# EAGLE design ALogShield (EAGLE 7.7.0)

## Sheet 1 of 2
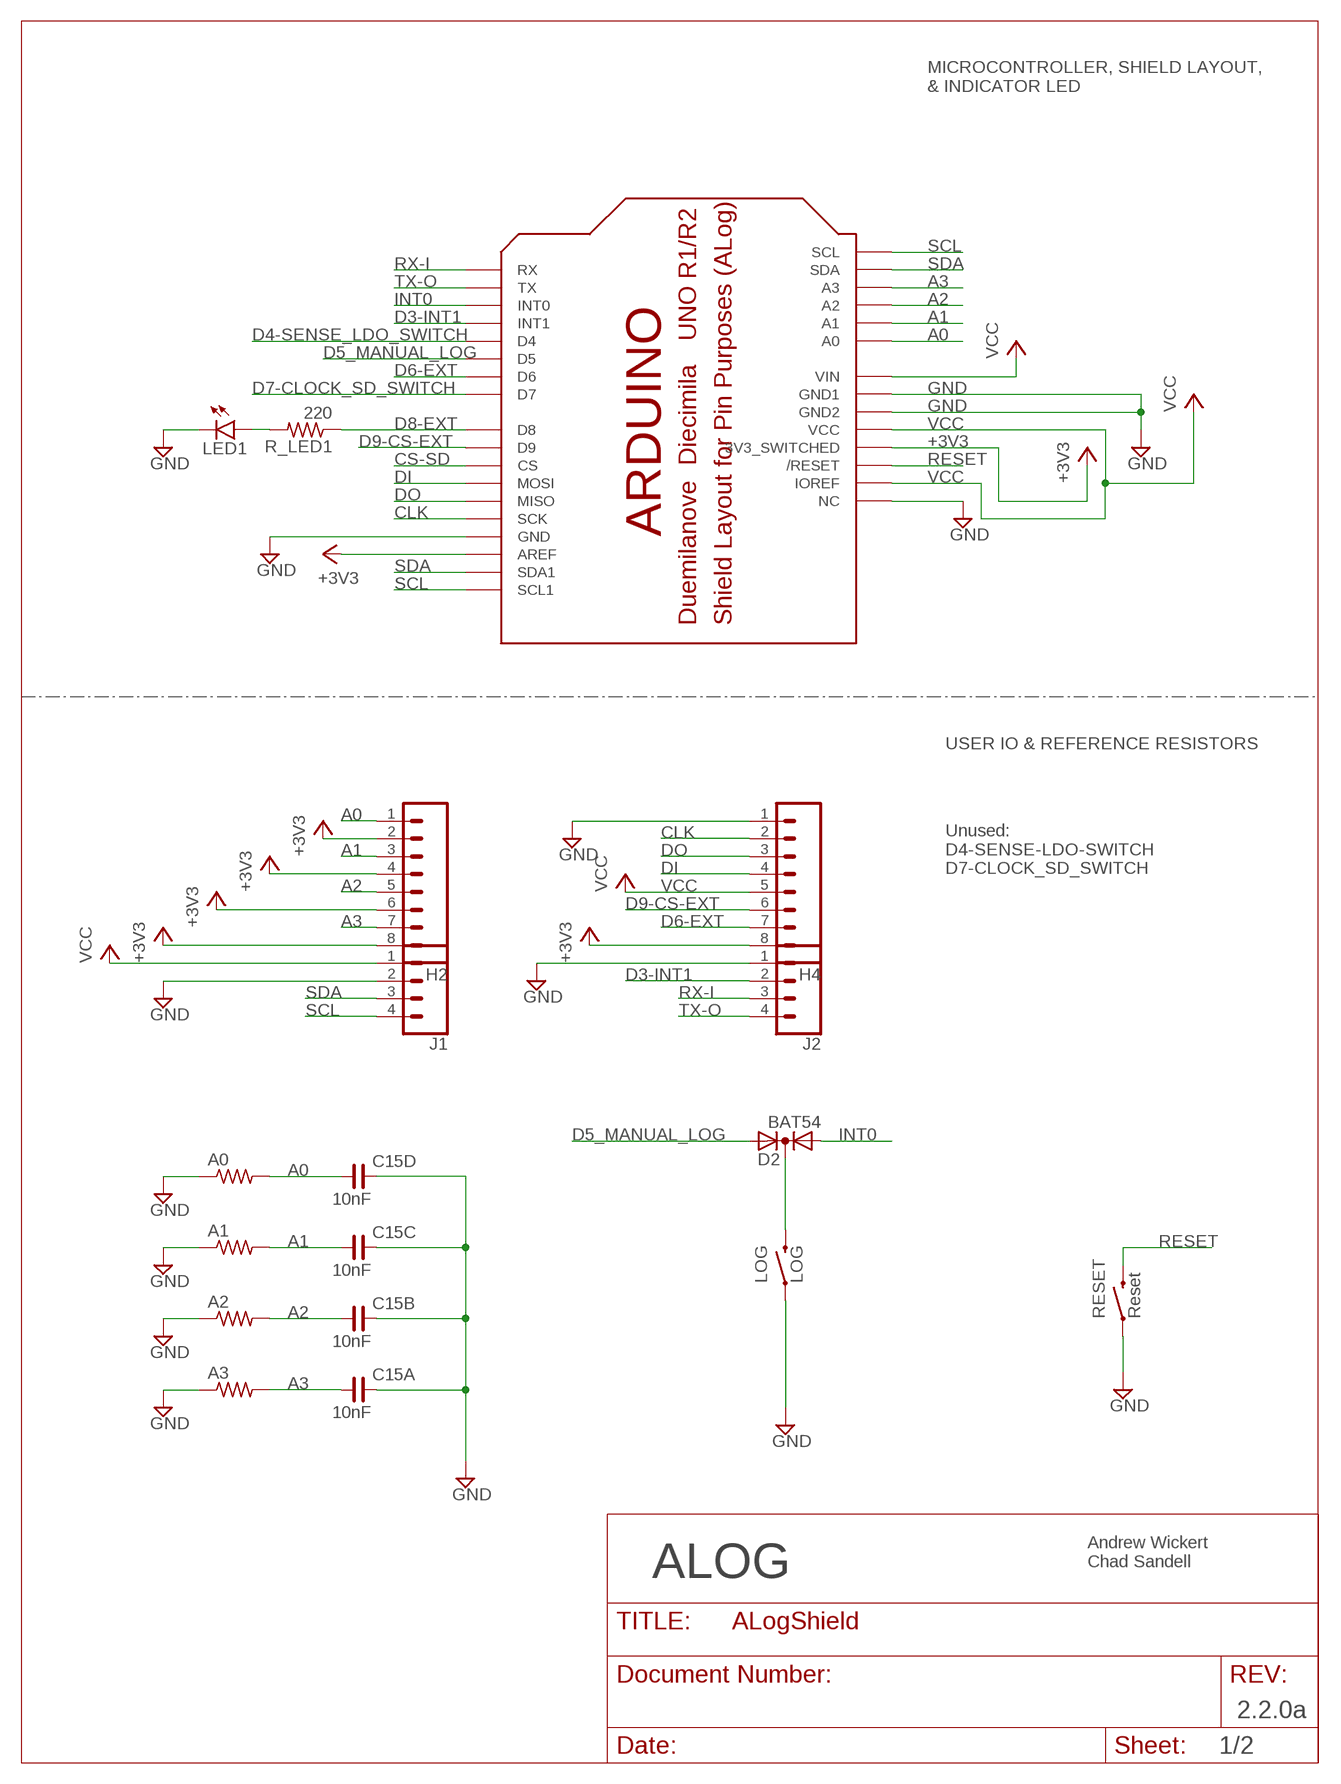
[diagram p0: schematic, sheet 1]

### Parts
A0  R-US_0207/10  [0207/10]
A1  R-US_0207/10  [0207/10]
A2  R-US_0207/10  [0207/10]
A3  R-US_0207/10  [0207/10]
C15  10nF  CCA_  [CECJ-CTS-031817]
D2  BAT54  DIODE_AC-CA_  [SOT23C]
H2  M083.5MM-8  [SCREWTERMINAL-3.5MM-8]
H4  M083.5MM-8  [SCREWTERMINAL-3.5MM-8]
J1  CONN_04SCREW  [SCREWTERMINAL-3.5MM-4]
J2  CONN_04SCREW  [SCREWTERMINAL-3.5MM-4]
LED1  LED1206  [LED-1206]
LOG  LOG  SWITCH-MOMENTARY-2PTH  [TACTILE-PTH]
R_LED1  220  R-US_R0603  [R0603]
RESET  Reset  SWITCH-MOMENTARY-2PTH  [TACTILE-PTH]
U$9  ARDUINO_SHIELD_PIN_PURPOSE  [ARDUINO_SHIELD_PINS_ONLY]

### Nets
+3V3: H2.2 H2.4 H2.6 H2.8 H4.8 U$9.3.3V(3V3_SWITCHED) U$9.AREF ; also sheet 2
A0: A0.2 C15.D1 H2.1 U$9.A0
A1: A1.2 C15.C1 H2.3 U$9.A1
A2: A2.2 C15.B1 H2.5 U$9.A2
A3: A3.2 C15.A1 H2.7 U$9.A3
CLK: H4.2 U$9.D13(SCK) ; also sheet 2
CS-SD: U$9.D10(CS) ; also sheet 2
D3-INT1: J2.2 U$9.D3(INT1)
D4-SENSE_LDO_SWITCH: U$9.D4
D5_MANUAL_LOG: D2.2(A2) U$9.D5
D6-EXT: H4.7 U$9.D6
D7-CLOCK_SD_SWITCH: U$9.D7
D8-EXT: R_LED1.1 U$9.D8
D9-CS-EXT: H4.6 U$9.D9
DI: H4.4 U$9.D11(MOSI) ; also sheet 2
DO: H4.3 U$9.D12(MISO) ; also sheet 2
GND: A0.1 A1.1 A2.1 A3.1 C15.A2 C15.B2 C15.C2 C15.D2 H4.1 J1.2 J2.1 LED1.C LOG.1 RESET.1 U$9.GND@0(GND) U$9.GND@1(GND1) U$9.GND@2(GND2) U$9.NC ; also sheet 2
INT0: D2.1(A1) U$9.D2(INT0) ; also sheet 2
LED+1: LED1.A R_LED1.2
N$11: D2.3(K) LOG.3
RESET: RESET.3 U$9.RES(/RESET)
RX-I: J2.3 U$9.RX
SCL: J1.4 U$9.A5(SCL) U$9.SCL(SCL1) ; also sheet 2
SDA: J1.3 U$9.A4(SDA) U$9.SDA(SDA1) ; also sheet 2
TX-O: J2.4 U$9.TX
VCC: H4.5 J1.1 U$9.5V(VCC) U$9.IOREF U$9.VIN ; also sheet 2

### Notes on the sheet
- MICROCONTROLLER, SHIELD LAYOUT,
  & INDICATOR LED
- USER IO & REFERENCE RESISTORS
- Unused:
  D4-SENSE-LDO-SWITCH
  D7-CLOCK_SD_SWITCH
- Andrew Wickert
  Chad Sandell
- ALOG
- 2.2.0a
- 1/2

## Sheet 2 of 2
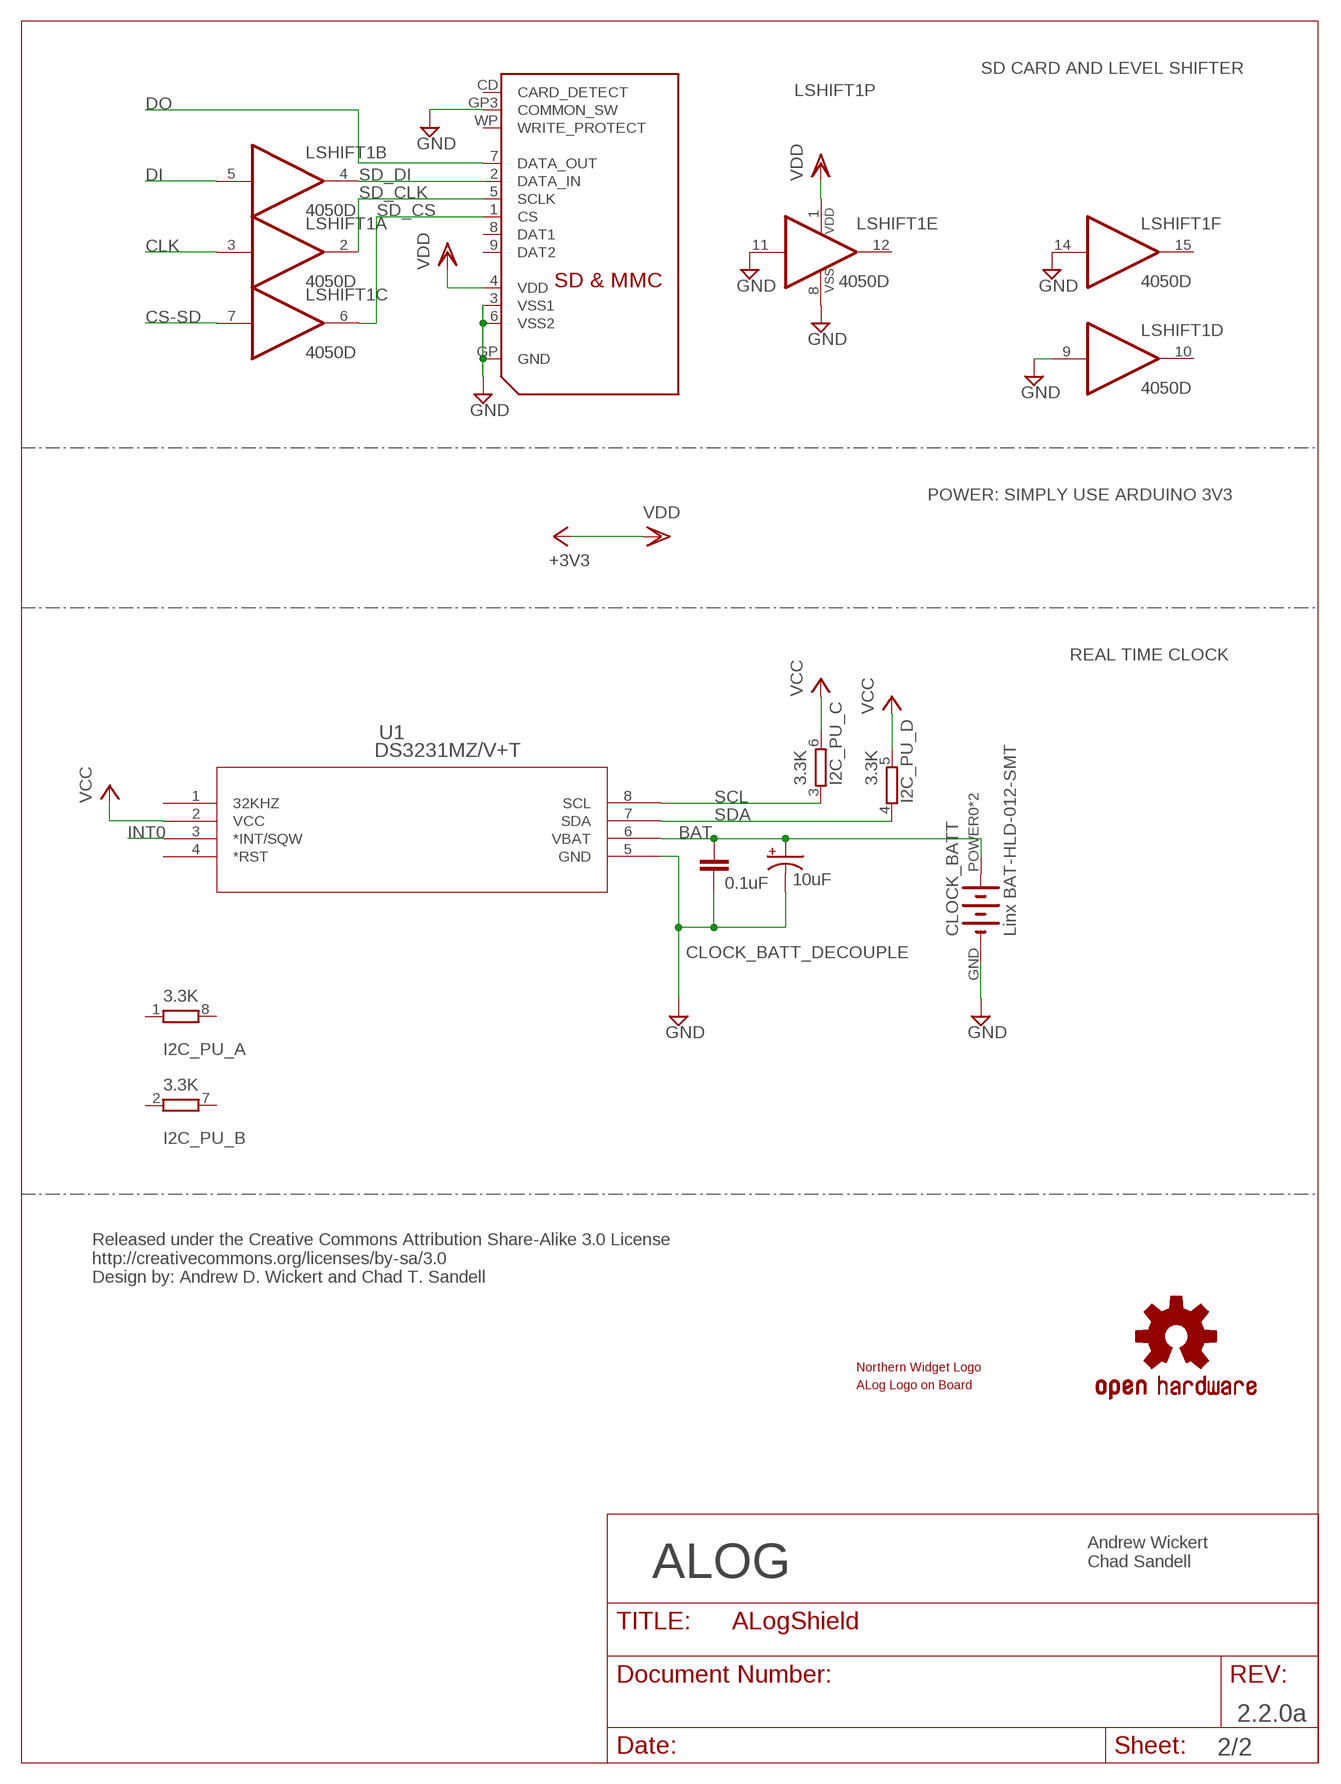
[diagram p1: schematic, sheet 2]

### Parts
CLOCK_BATT  Linx BAT-HLD-012-SMT  LINX-BAT-HLD-012-SMT-OTL  [LINX_BAT-HLD-012-SMT]
CLOCK_BATT_DECOUP  0.1uF  C-EUC0603  [C0603]
CLOCK_BATT_DECOUPLE  10uF  CAP_POL1206  [EIA3216]
I2C_PU_  3.3K  4R-N0603-ARC  [0603-ARC]
LOGO2  OSHW-LOGOM  [OSHW-LOGO-M]
LSHIFT1  4050D  [SO16]
SD1  SDMMC06132  [06132]
U1  DS3231MZ/V+T  [21-0041B_8]
U$1  ALOG_LOGO_V1_5.5MM  [ALOG_LOGO_V1_SMALL]
U$4  NWLOGO  [NWLOGO]

### Nets
BAT: CLOCK_BATT.POWER0(+) CLOCK_BATT.POWER1(+) CLOCK_BATT_DECOUP.1 CLOCK_BATT_DECOUPLE.A(+) U1.6(VBAT)
CLK: LSHIFT1.3(A:I) ; also sheet 1
CS-SD: LSHIFT1.7(C:I) ; also sheet 1
DI: LSHIFT1.5(B:I) ; also sheet 1
DO: SD1.7(DATA_OUT) ; also sheet 1
GND: CLOCK_BATT.GND(-) CLOCK_BATT_DECOUP.2 CLOCK_BATT_DECOUPLE.C(-) LSHIFT1.8(P:VSS) LSHIFT1.9(D:I) LSHIFT1.11(E:I) LSHIFT1.14(F:I) SD1.3(VSS1) SD1.6(VSS2) SD1.GP3(COMMON_SW) SD1.GP(GND) U1.5(GND) ; also sheet 1
INT0: U1.3(*INT/SQW) ; also sheet 1
SCL: I2C_PU_.3 U1.8(SCL) ; also sheet 1
SD_CLK: LSHIFT1.2(A:O) SD1.5(SCLK)
SD_CS: LSHIFT1.6(C:O) SD1.1(CS)
SD_DI: LSHIFT1.4(B:O) SD1.2(DATA_IN)
SDA: I2C_PU_.4 U1.7(SDA) ; also sheet 1
VCC: I2C_PU_.5 I2C_PU_.6 U1.2(VCC) ; also sheet 1
VDD: LSHIFT1.1(P:VDD) SD1.4(VDD)
Unconnected: I2C_PU_.1 I2C_PU_.2 I2C_PU_.7 I2C_PU_.8 LSHIFT1.10(D:O) LSHIFT1.12(E:O) LSHIFT1.15(F:O) SD1.8(DAT1) SD1.9(DAT2) SD1.CD(CARD_DETECT) SD1.WP(WRITE_PROTECT) U1.1(32KHZ) U1.4(*RST)

### Notes on the sheet
- SD CARD AND LEVEL SHIFTER
- POWER: SIMPLY USE ARDUINO 3V3
- REAL TIME CLOCK
- Released under the Creative Commons Attribution Share-Alike 3.0 License
  http://creativecommons.org/licenses/by-sa/3.0
  Design by: Andrew D. Wickert and Chad T. Sandell
- Andrew Wickert
  Chad Sandell
- ALOG
- 2.2.0a
- 2/2

## Library data of the parts
A0 A1-A3 R_LED1 = resistor:R-US_: RESISTOR, American symbol
C15 = rc-master-smd:CCA_: CHIP CAP ARRAY
CLOCK_BATT = awickert:LINX-BAT-HLD-012-SMT-OTL
CLOCK_BATT_DECOUP = rcl:C-EU: CAPACITOR, European symbol
CLOCK_BATT_DECOUPLE = SparkFun-Passives:CAP_POL: Capacitor Polarized These are standard SMD and PTH capacitors. Normally 10uF, 47uF, and 100uF in electrolytic and tantalum varieties. Always verify the external diameter of the through hole cap, it varies with capacity, voltage, and manufacturer. The EIA devices should be standard.
D2 = semicon-smd-ipc:DIODE_AC-CA_: DUAL DIODE
H2 H4 = SparkFun:M08: Header 8 Standard 8-pin 0.1" header. Use with straight break away headers (SKU : PRT-00116), right angle break away headers (PRT-00553), swiss pins (PRT-00743), machine pins (PRT-00117), and female headers (PRT-00115).
I2C_PU_ = resistor-dil:4R-N: Array Chip Resistor Source: RS Component / Phycomp; OC_FARNELL: unknown; OC_NEWARK: unknown
J1 J2 = SparkFun-Connectors:CONN_04: Multi connection point. Often used as Generic Header-pin footprint for 0.1 inch spaced/style header connections On any of the 0.1 inch spaced packages, you can populate with these: Break Away Headers - Straight <https://www.sparkfun.com/products/116> (PRT-00116) Break Away Male Headers - Right Angle <https://www.sparkfun.com/products/553> (PRT-00553) Female Headers <https://www.sparkfun.com/products/115> (PRT-00115) Break Away Headers - Machine Pin <https://www.sparkfun.com/products/117> (PRT-00117) Break Away Female Headers - Swiss Machine Pin <https://www.sparkfun.com/products/743> (PRT-00743) For SCREWTERMINALS and SPRING TERMINALS visit here: Screw Terimnals on SparkFun.com <https://www.sparkfun.com/search/results?term=Screw+Terminals> (5mm/3.5mm/2.54mm spacing) This device is also useful as a general connection point to wire up your design to another part of your project. Our various solder wires solder well into these plated through hole pads. Hook-Up Wire - Assortment (Stranded, 22 AWG) <https://www.sparkfun.com/products/11375> (PRT-11375) Hook-Up Wire - Assortment (Solid Core, 22 AWG) <https://www.sparkfun.com/products/11367> (PRT-11367) View the entire wire category on our website here <https://www.sparkfun.com/categories/141> Special notes: Molex polarized connector foot print use with SKU : PRT-08231 with associated crimp pins and housings. 1MM SMD Version SKU: PRT-10208; PROD_ID: 2xCONN-08399; SF_ID: 2xPRT-08084
LED1 = SparkFun-LED:LED: LEDs Standard schematic elements and footprints for 5mm, 3mm, 1206, and 0603 sized LEDs. 5mm - Spark Fun Electronics SKU : COM-00529 (and others)
LOG RESET = SparkFun-Electromechanical:SWITCH-MOMENTARY-2: Various NO switches- pushbuttons, reed, etc; PROD_ID: SWCH-08441
LOGO2 = SparkFun-Aesthetics:OSHW-LOGO: Open Source Hardware Logo This logo indicates the piece of hardware it is found on incorporates a OSHW license and/or adheres to the definition of open source hardware found here: http://freedomdefined.org/OSHW
LSHIFT1 = 40xx:4050: Hex non-inverting BUFFER
SD1 = adafruit:SDMMC: SD MMC Card holder 4UCON part #06132 - easy to solder
U1 = Maxim-DS3231MZ_8-SOIC:DS3231MZ/V+T; MANUFACTURER_NAME: Maxim; MANUFACTURER_PART_NUMBER: DS3231MZ/V+T; VENDOR: Maxim
U$1 = awickert:ALOG_LOGO_V1_5.5MM
U$4 = awickert:NWLOGO
U$9 = awickert:ARDUINO_SHIELD_PIN_PURPOSE

## Net classes
0 default: width 0.203 mm, drill 0.305 mm
1 power: width 0.254 mm

## Board
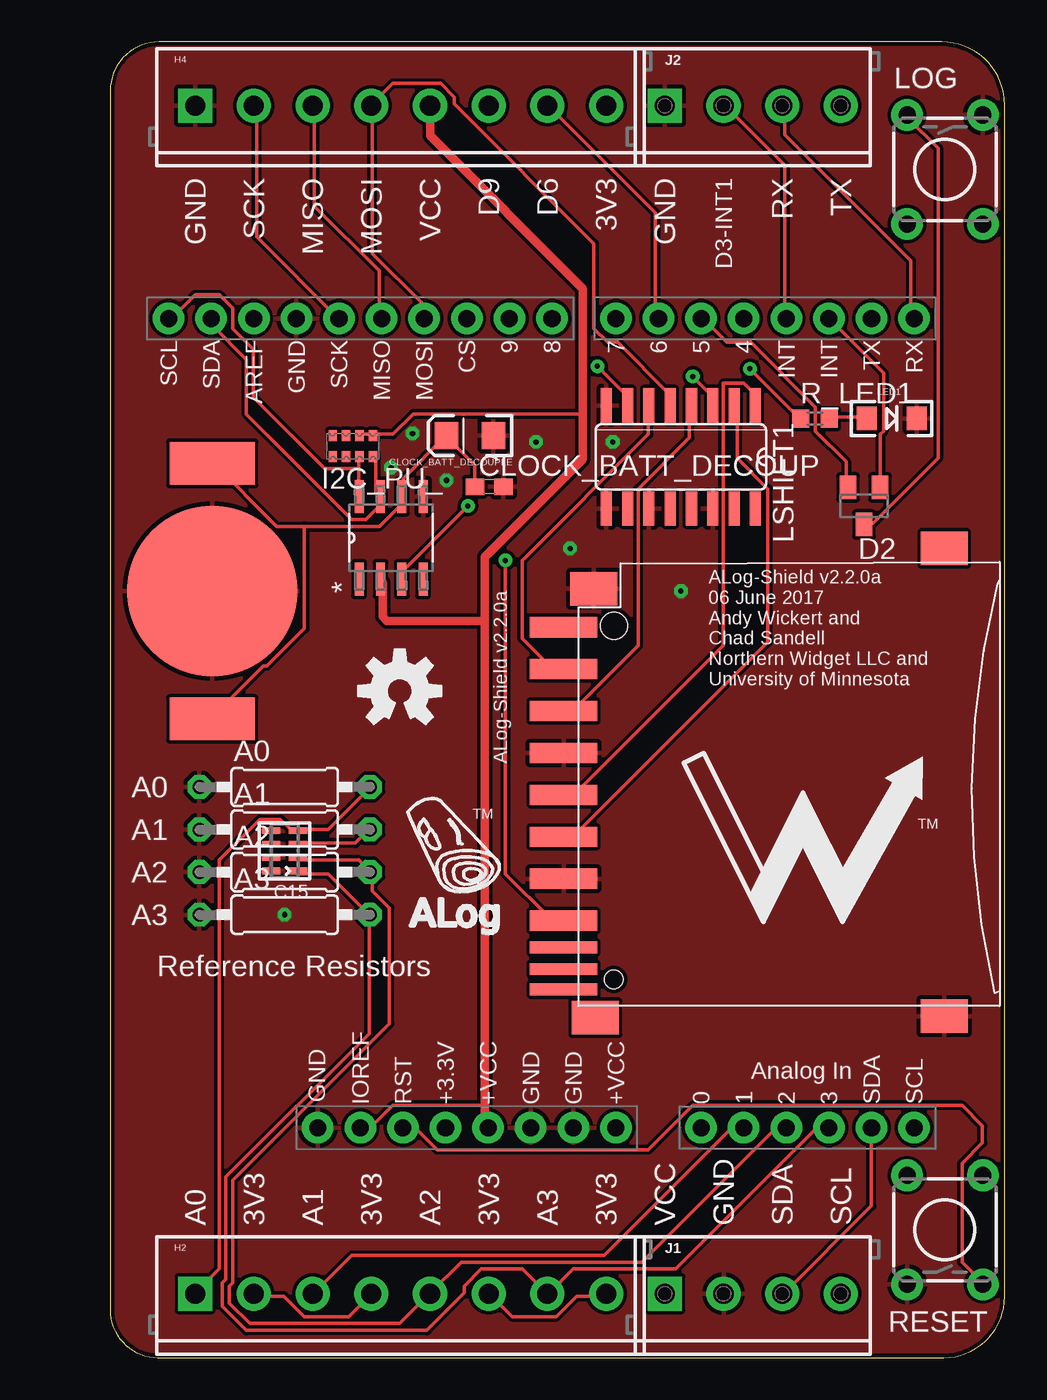
[diagram p2: board, top side]
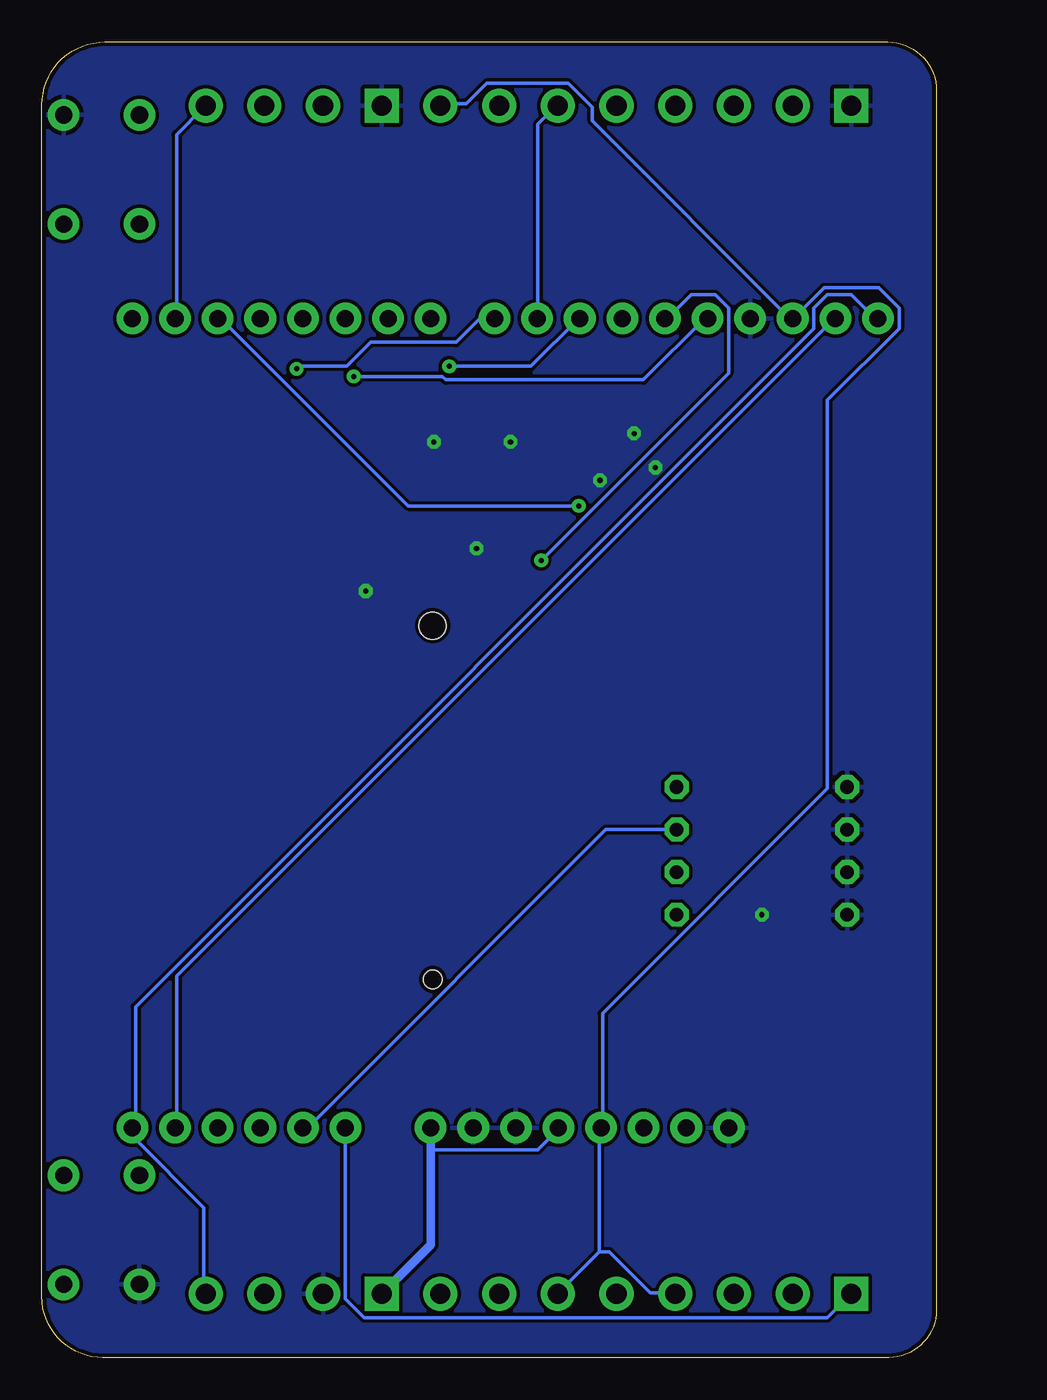
[diagram p3: board, bottom side, seen from below]

Size 53.33 x 78.47 mm. Coordinates in mm from the lower left corner, seen from the top.
Outline: 53.33,74.72 arc90 49.57,78.47 2.91,78.47 arc90 0,75.56 0,2.85 arc90 2.85,0 49.71,0 arc90 53.33,3.62 53.33,74.72
Copper layers (1*16): Top 0.035mm / dielectric 1.5mm / Bottom 0.035mm
Design rules "SparkFun *": minimum track width 8mil, minimum drill 12mil, track to track 8mil, track to pad 8mil, pad to pad 8mil, via to via 8mil, smd to smd 8mil, copper to edge 10mil, drill to drill 8mil, minimum pad ring 12mil, minimum via ring 10mil, stop-mask expansion 4mil, vias tented up to drill 25mil, thermal gap 10mil

### Footprints (pad centres in the part's own frame; a part is rotated, then mirrored left to right if it is on the bottom)
0207/10 = drill 0.813 octagon: 1 -5.08,0; 2 5.08,0
CECJ-CTS-031817 = smd 0.406 x 1.1: A1 -1.2,-0.8; A2 -1.2,0.8; B1 -0.4,-0.8; B2 -0.4,0.8; C1 0.4,-0.8; C2 0.4,0.8; D1 1.2,-0.8; D2 1.2,0.8
LINX_BAT-HLD-012-SMT = smd 10.16 x 10.16: GND 0,0 | smd 2.54 x 5.08: POWER0 -7.62,0; POWER1 7.62,0
C0603 = smd 1.1 x 1: 1 -0.85,0; 2 0.85,0
EIA3216 = smd 1.4 x 1.6: A 1.4,0; C -1.4,0
SOT23C = smd 1 x 1.4: 1 -0.95,-1.1; 2 0.95,-1.1; 3 0,1.1
SCREWTERMINAL-3.5MM-8 = drill 1.2 pad 2.032 square: 1 0,0 | drill 1.2 pad 2.032: 2 3.5,0; 3 7,0; 4 10.5,0; 5 14,0; 6 17.5,0; 7 21,0; 8 24.5,0
0603-ARC = smd 0.5 x 0.65: 1 -1.2,-0.625; 2 -0.4,-0.625; 3 0.4,-0.625; 4 1.2,-0.625; 5 1.2,0.625; 6 0.4,0.625; 7 -0.4,0.625; 8 -1.2,0.625
SCREWTERMINAL-3.5MM-4 = drill 1.2 pad 2.032 square: 1 0,0 | drill 1.2 pad 2.032: 2 3.5,0; 3 7,0; 4 10.5,0
LED-1206 = smd 1.2 x 1.4: A -1.5,0; C 1.5,0
TACTILE-PTH = drill 1.016 pad 1.88: 1 -3.251,2.261; 2 3.251,2.261; 3 -3.251,-2.261; 4 3.251,-2.261
SO16 = smd 0.66 x 2.032: 1 -4.445,-3.073; 2 -3.175,-3.073; 3 -1.905,-3.073; 4 -0.635,-3.073; 5 0.635,-3.073; 6 1.905,-3.073; 7 3.175,-3.073; 8 4.445,-3.073; 9 4.445,3.073; 10 3.175,3.073; 11 1.905,3.073; 12 0.635,3.073; 13 -0.635,3.073; 14 -1.905,3.073; 15 -3.175,3.073; 16 -4.445,3.073
R0603 = smd 1 x 1.1: 1 -0.85,0; 2 0.85,0
06132 = smd 1.2 x 4: 1 6.9,0.9; 2 4.4,0.9; 3 1.9,0.9; 4 -0.6,0.9; 5 -3.1,0.9; 6 -5.6,0.9; 7 -8.1,0.9; 9 9.4,0.9 | smd 0.7 x 4: 8 -9.7,0.9; CD -11,0.9; WP -12.2,0.9 | smd 2 x 2.8: GP -13.8,-21.8; GP2 14.1,-21.8; GP3 11.7,-0.9; GP4 -13.9,-1 | hole 1.1: -11.6,-2.1 | hole 1.6: 9.5,-2.1
21-0041B_8 = smd 1.981 x 0.533: 1 -2.464,1.905; 2 -2.464,0.635; 3 -2.464,-0.635; 4 -2.464,-1.905; 5 2.464,-1.905; 6 2.464,-0.635; 7 2.464,0.635; 8 2.464,1.905
ARDUINO_SHIELD_PINS_ONLY = drill 1.016 pad 1.88: 3.3V 50.8,26.67; 5V 50.8,29.21; A0 50.8,41.91; A1 50.8,44.45; A2 50.8,46.99; A3 50.8,49.53; A4 50.8,52.07; A5 50.8,54.61; AREF 2.54,15.24; D2 2.54,49.53; D3 2.54,46.99; D4 2.54,44.45; D5 2.54,41.91; D6 2.54,39.37; D7 2.54,36.83; D8 2.54,33.02; D9 2.54,30.48; D10 2.54,27.94; D11 2.54,25.4; D12 2.54,22.86; D13 2.54,20.32; GND@0 50.8,31.75; GND@1 50.8,34.29; GND@2 2.54,17.78; IOREF 50.8,21.59; NC 50.8,19.05; RES 50.8,24.13; RX 2.54,54.61; SCL 2.54,10.16; SDA 2.54,12.7; TX 2.54,52.07; VIN 50.8,36.83

### Placement (x,y rotation side)
A0  10.4,34.04 0 top
A1  10.4,31.5 0 top
A2  10.4,28.96 0 top
A3  10.4,26.42 0 top
C15  10.4,30.23 90 top
CLOCK_BATT  6.09,45.72 90 top
CLOCK_BATT_DECOUP  22.6,51.94 0 top
CLOCK_BATT_DECOUPLE  21.45,54.99 180 top
D2  44.95,50.8 180 top
H2  5.07,3.81 0 top
H4  5.07,74.68 0 top
I2C_PU_  14.47,54.36 0 top
J1  33.07,3.81 0 top
J2  33.07,74.68 0 top
LED1  46.6,56.01 0 top
LOG  49.77,70.87 270 top
LOGO2  17.26,39.75 0 top
LSHIFT1  34.03,53.72 180 top
R_LED1  42.03,56.01 0 top
RESET  49.77,7.62 90 top
SD1  27.93,34.16 90 top
U1  16.75,48.9 90 top
U$1  20.56,30.48 0 top
U$4  41.27,30.61 0 top
U$9  -6.68,64.52 270 top

### Tracks (layer width: path | path; a pad name or v marks a point on that pad's centre or on a via)
+3V3
  Top 0.203: H2.2 8.73,3.66 10.35,3.66 11.57,2.44 14.21,2.44 15.43,3.66 H2.4 | H2.8 29.45,3.66 27.83,3.66 26.61,2.44 23.97,2.44 22.75,3.66 H2.6
  Bottom 0.203: 20.11,6.3 20.11,13.61 U$9.3.3V 19.9,13.82 19.9,20.52 6.49,33.93 6.49,57.1 2.23,61.37 2.23,62.59 3.44,63.8 6.7,63.8 8.52,61.98 U$9.AREF 8.73,61.98 20.51,73.76 20.51,74.57 21.94,76 26.81,76 28.03,74.78 29.45,74.78 H4.8 | 20.11,6.3 22.54,3.86 H2.6 | 20.11,6.3 19.5,6.3 17.06,3.86 15.64,3.86 H2.4
A0
  Top 0.203: A0.2 15.43,33.93 13,31.5 11.37,31.5 C15.D1 11.17,31.5 10.76,31.5 10.15,32.11 8.93,32.11 6.49,29.67 6.49,5.28 5.07,3.86 H2.1
  Bottom 0.203: U$9.A0 35.23,3.49 34.12,2.38 6.5,2.38 H2.1
A1
  Top 0.203: U$9.A1 37.58,13.61 36.97,13.61 29.45,6.1 14.42,6.1 12.18,3.86 H2.3 | C15.C1 11.37,30.68 14.62,30.68 15.43,31.5 A1.2
  Bottom 0.203: A1.2 19.7,31.5 37.58,13.61 U$9.A1
A2
  Top 0.203: U$9.A2 40.22,13.61 39.61,13.61 31.69,5.69 20.92,5.69 19.09,3.86 H2.5 18.89,3.66 17.26,2.03 8.32,2.03 7.1,3.25 7.1,4.27 7.31,4.47 7.31,10.57 16.65,19.91 16.65,26.82 15.64,27.84 15.64,28.85 A2.2 15.43,29.06 14.82,29.67 11.37,29.67 C15.B1
A3
  Top 0.203: U$9.A3 42.66,13.61 42.05,13.61 33.72,5.28 27.62,5.28 26.2,3.86 H2.7 26,3.86 24.58,5.28 22.14,5.28 21.12,4.27 21.12,3.86 18.89,1.63 8.12,1.63 6.7,3.05 6.7,4.47 6.9,4.67 6.9,10.77 15.43,19.3 15.43,26.42 | 15.43,26.42 13,28.85 11.37,28.85 C15.A1 | 15.43,26.42 A3.2
BAT
  Top 0.203: CLOCK_BATT_DECOUP.1 21.73,52.02 21.73,53.24 20.11,54.86 CLOCK_BATT_DECOUPLE.A 19.9,54.86 17.46,52.43 17.46,51.41 U1.6 17.26,51.21 17.26,50.8 16.04,49.58 11.57,49.58 | 11.57,49.58 9.95,49.58 6.09,53.44 CLOCK_BATT.POWER1 | 11.57,49.58 11.57,43.48 9.34,41.25 9.13,41.25 6.09,38.2 CLOCK_BATT.POWER0
CLK  (via drill 0.3)
  Top 0.203: H4.2 8.73,74.57 8.73,66.85 13.6,61.98 U$9.D13 | v34.74,58.52 35.75,57.51 35.75,56.9 LSHIFT1.3
  Bottom 0.203: v34.74,58.52 29.45,58.52 29.25,58.32 17.46,58.32 13.81,61.98 U$9.D13
CS-SD  (via drill 0.3)
  Top 0.203: v29.05,59.13 30.67,57.51 30.67,56.9 LSHIFT1.7
  Bottom 0.203: v29.05,59.13 24.17,59.13 21.33,61.98 U$9.D10
D3-INT1
  Top 0.203: U$9.D3 40.22,61.98 40.22,71.12 36.77,74.57 J2.2
D5_MANUAL_LOG
  Top 0.203: D2.2 43.88,52.02 43.88,53.44 42.05,55.27 42.05,56.69 38.19,60.55 36.77,60.55 35.35,61.98 U$9.D5
D6-EXT
  Top 0.203: U$9.D6 32.5,61.98 32.5,68.28 26.2,74.57 H4.7
D8-EXT  (via drill 0.3)
  Top 0.203: R_LED1.1 41.04,56.08 v38.14,58.98
  Bottom 0.203: v38.14,58.98 37.99,59.13 35.14,59.13 33.72,60.55 28.64,60.55 27.22,61.98 U$9.D8
D9-CS-EXT
  Bottom 0.203: U$9.D9 23.76,61.98 23.76,73.56 22.75,74.57 H4.6
DI
  Top 0.203: U$9.D11 18.68,61.98 18.68,62.79 15.64,65.84 15.64,74.57 H4.4 15.64,74.78 16.86,76 19.7,76 20.51,75.18 20.51,74.78 28.84,66.45 28.84,61.37 29.66,60.55 30.27,60.55 33.32,57.51 33.32,56.9 LSHIFT1.5
DO  (via drill 0.3)
  Top 0.203: U$9.D12 16.04,61.98 16.04,64.82 12.18,68.68 12.18,74.57 H4.3 | v23.56,47.55 23.56,28.85 26.2,26.21 27.02,26.21 SD1.7
  Bottom 0.203: v23.56,47.55 12.38,58.73 12.38,62.59 13.2,63.4 14.62,63.4 16.04,61.98 U$9.D12
GND  (via drill 0.3)
  Top 0.203: 23.36,52.22 CLOCK_BATT_DECOUP.2 | 9.54,29.26 9.6,29.24
  other vias: 20.06,52.32 27.42,48.26 18.02,55.12 34.03,45.72 10.4,26.42 16.75,53.09 25.39,54.61 29.96,54.61
  pour Bottom: -1.28,78.74 -1.28,-1.27 54.6,-1.27 54.6,78.74
  pour Top: -1.28,78.74 -1.28,-1.27 54.6,-1.27 54.6,78.74
INT0  (via drill 0.3)
  Top 0.203: D2.1 45.91,52.02 45.91,55.07 46.12,55.27 46.12,58.73 42.87,61.98 U$9.D2 | v21.33,50.8 17.46,46.94 17.46,46.53 U1.3
  Bottom 0.203: v21.33,50.8 31.49,50.8 42.66,61.98 U$9.D2
LED+1
  Top 0.203: R_LED1.2 43.07,56.08 44.9,56.08 LED1.A
N$11
  Top 0.203: D2.3 45.1,49.78 45.51,49.78 49.37,53.65 49.37,72.14 47.54,73.97 LOG.3
RESET
  Top 0.203: RESET.3 52.01,4.47 50.79,5.69 50.79,11.58 52.01,12.8 52.01,13.82 50.79,15.04 34.74,15.04 32.1,12.39 19.5,12.39 18.28,13.61 17.46,13.61 U$9.RES
RX-I
  Top 0.203: U$9.RX 47.74,61.98 47.74,65.43 40.22,72.95 40.22,74.57 J2.3
SCL
  Top 0.203: 14.82,53.03 14.82,51.41 U1.8 | 14.82,53.03 14.82,53.65 I2C_PU_.3 | 14.82,53.03 12.79,53.03 8.52,57.3 8.52,60.15 7.31,61.37 7.31,62.59 6.49,63.4 5.07,63.4 3.65,61.98 U$9.SCL
  Bottom 0.203: J1.4 43.68,3.86 43.68,8.94 47.74,13.01 47.74,13.61 U$9.A5 47.74,13.82 47.74,20.93 7.31,61.37 7.31,62.59 6.49,63.4 5.07,63.4 3.65,61.98 U$9.SCL
SD_CLK
  Top 0.203: LSHIFT1.2 37.38,56.69 37.38,53.65 39.21,51.82 39.21,42.67 27.62,31.09 27.22,31.09 SD1.5
SD_CS
  Top 0.203: LSHIFT1.6 32.1,56.69 32.1,55.07 24.58,47.55 24.58,42.88 26.2,41.25 27.02,41.25 SD1.1
SD_DI
  Top 0.203: LSHIFT1.4 34.53,56.69 34.53,54.86 31.49,51.82 31.49,42.47 27.62,38.61 27.22,38.61 SD1.2
SDA
  Top 0.203: 16.25,51.41 U1.7 | U1.7 16.04,51.21 16.04,50.8 15.23,49.99 14.42,49.99 8.12,56.29 8.12,59.54 6.09,61.57 6.09,61.98 U$9.SDA | I2C_PU_.4 15.84,53.65 15.84,51.61 16.04,51.41 U1.7 | U$9.A4 45.39,9.05 40.15,3.81 J1.3
  Bottom 0.203: U$9.A4 45.3,13.82 45.3,22.76 6.09,61.98 U$9.SDA
TX-O
  Bottom 0.203: U$9.TX 45.3,61.98 45.3,72.95 43.68,74.57 J2.4
VCC
  Top 0.203: I2C_PU_.6 15.03,55.07 15.64,55.07 I2C_PU_.5 15.84,55.07 16.86,55.07 18.07,56.29 28.18,56.29 | 22.34,15.04 16.86,15.04 15.64,13.82 15.03,13.82 U$9.IOREF
  Top 0.508: H4.5 19.07,72.87 28.18,63.75 28.18,56.29 28.18,53.59 22.34,47.75 22.34,43.94 | 22.34,43.94 22.34,15.04 22.34,13.72 U$9.5V | 22.34,43.94 16.5,43.94 16.25,44.2 16.25,46.23 U1.2
  Bottom 0.203: 30.15,12.39 23.76,12.39 22.54,13.61 U$9.5V
  Bottom 0.508: U$9.VIN 30.15,12.39 30.15,6.73 J1.1
VDD
  Top 0.203: LSHIFT1.1 38.4,56.9 38.4,57.51 37.79,58.12 36.57,58.12 36.57,42.47 27.83,33.73 27.22,33.73 SD1.4

### Text on the board
tPlace: GND | SCK | MISO | MOSI | VCC | D9 | D6 | 3V3 | GND | D3-INT1 | RX | TX | ALog-Shield v2.2.0a / 06 June 2017 / Andy Wickert and / Chad Sandell / Northern Widget LLC and / University of Minnesota | ALog-Shield v2.2.0a | A0 | TM | TM | A1 | A2 | A3 | Reference Resistors | GND | A0 | 3V3 | A1 | 3V3 | A2 | 3V3 | A3 | 3V3 | VCC | GND | SDA | SCL